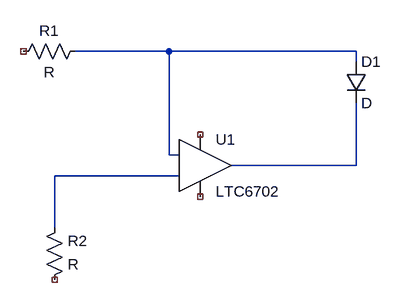
[diagram p0: schematic Draft1.asc]
Draft1.asc, the LTspice schematic file:
Version 4
SHEET 1 880 680
WIRE 192 -16 48 -16
WIRE 480 -16 192 -16
WIRE 480 0 480 -16
WIRE 192 144 192 -16
WIRE 208 144 192 144
WIRE 480 160 480 64
WIRE 480 160 288 160
WIRE 208 176 16 176
WIRE 16 256 16 176
SYMBOL Comparators\\LTC6702 240 160 R0
SYMATTR InstName U1
SYMBOL diode 464 0 R0
SYMATTR InstName D1
SYMBOL res 64 -32 R90
WINDOW 0 0 56 VBottom 2
WINDOW 3 32 56 VTop 2
SYMATTR InstName R1
SYMBOL res 0 352 M180
WINDOW 0 36 76 Left 2
WINDOW 3 36 40 Left 2
SYMATTR InstName R2

The netlist it stands for:
* Draft1.asc
XU1 N003 N001 NC_01 NC_02 N002 LTC6702
D1 N001 N002 D
R1 N001 NC_03 R
R2 NC_04 N003 R
.model D D
.lib standard.dio
.lib LTC3.lib
.backanno
.end